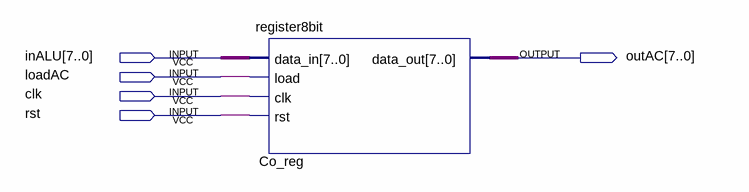
[diagram p0: schematic sheet]
// Quartus schematic regAC.bdf as structural Verilog: 1 symbols, 5 pins
module regAC (
  input  [7:0] inALU,
  input  loadAC,
  input  clk,
  input  rst,
  output [7:0] outAC
);

  register8bit Co_reg (.data_in(inALU), .load(loadAC), .clk(clk), .rst(rst), .data_out(outAC));
endmodule
